# Altium schematic sheet IPT-LXe Top.SchDoc
size 393 x 520 mm; SheetNumber: 0; SheetTotal: 0; PageSetup: Record=PageOptions|CenterHorizontal=True|CenterVertical=True|PrintScale=0.50|XCorrection=1.00|YCorrection=1.00|PrintKind=2|BorderSize=5000000|LeftOffset=0|BottomOffset=0|Orientation=1|PaperLength=1000|PaperWidth=1000|Scale=100|PaperSource=257|PrintQuality=600|MediaType=1|DitherType=10|PaperKind=A2|PrintScaleMode=1
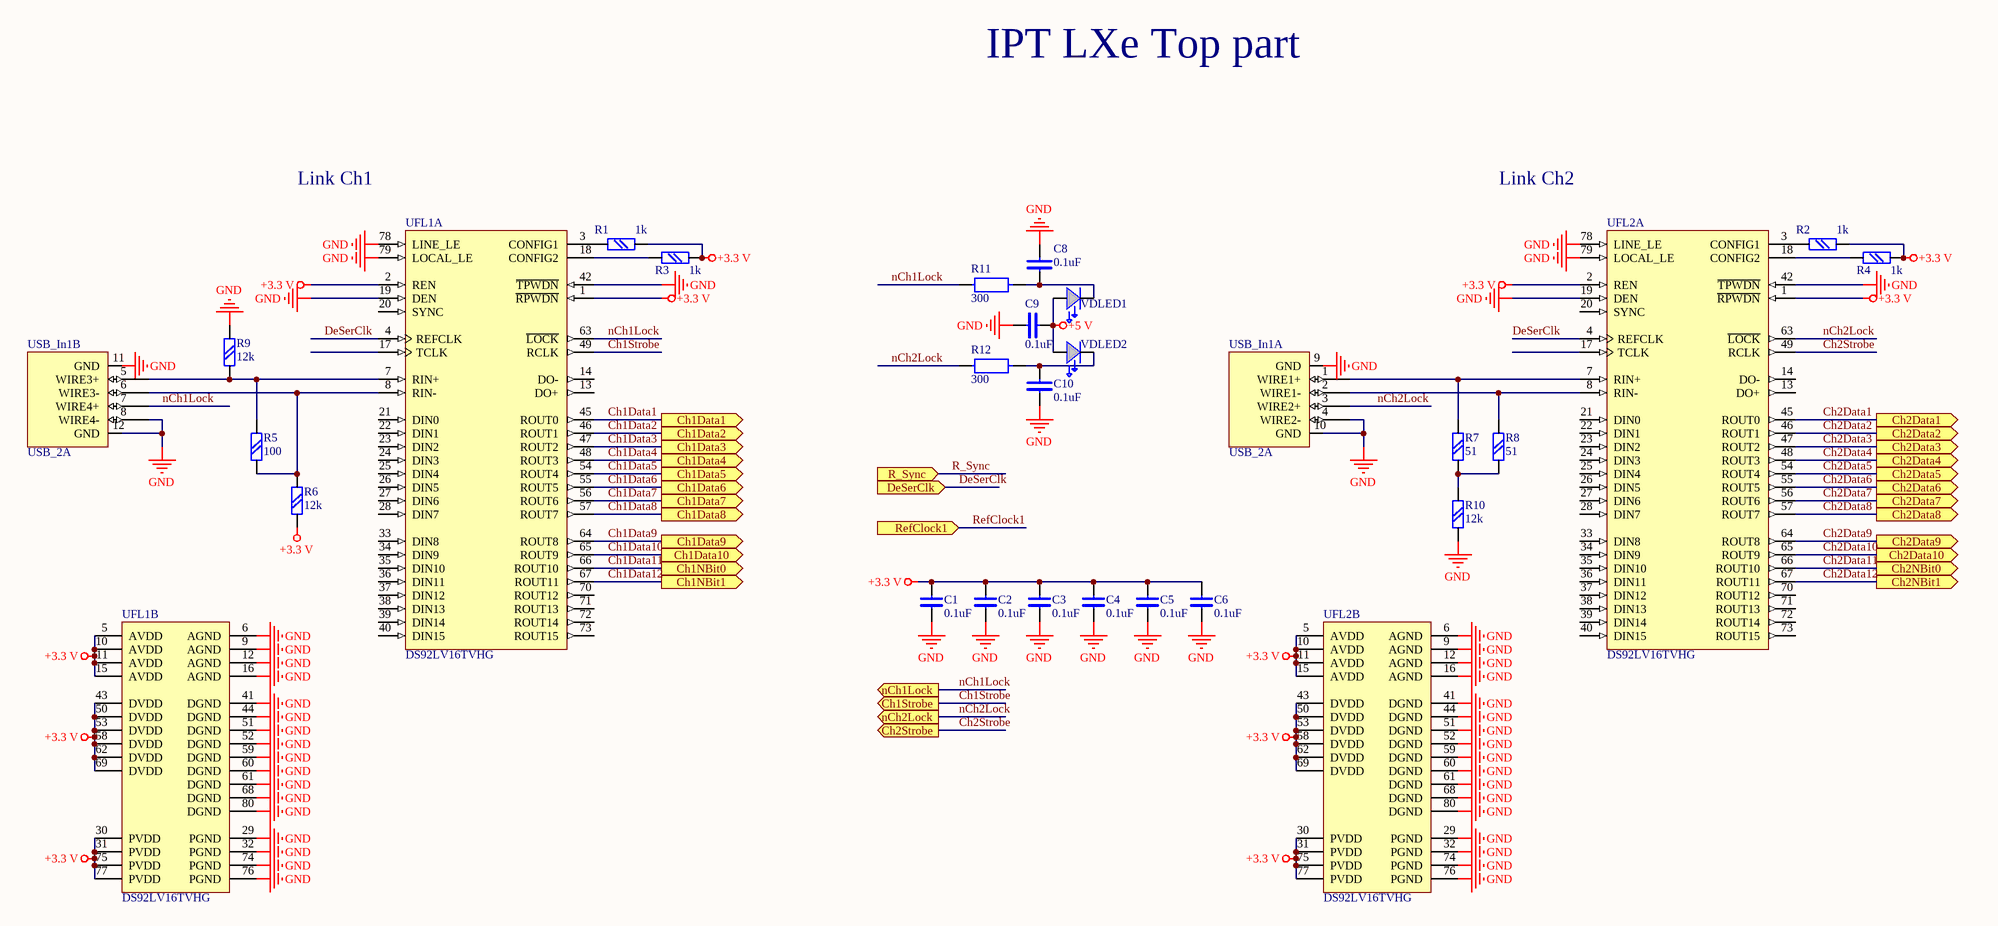
[diagram p0: IPT-LXe Top.SchDoc]

## Parts
C1  0.1uF  [chip0805]
C2  0.1uF  [chip0805]
C3  0.1uF  [chip0805]
C4  0.1uF  [chip0805]
C5  0.1uF  [chip0805]
C6  0.1uF  [chip0805]
C8  0.1uF  [chip0805]
C9  0.1uF  [chip0805]
C10  0.1uF  [chip0805]
R1  1k  [chip0805]
R2  1k  [chip0805]
R3  1k  [chip0805]
R4  1k  [chip0805]
R5  100  [chip0805]
R6  12k  [chip0805]
R7  51  [chip0805]
R8  51  [chip0805]
R9  12k  [chip0805]
R10  12k  [chip0805]
R11  300  [chip0805]
R12  300  [chip0805]
UFL1  DS92LV16TVHG  [VHG80A_N]  (parts A,B of 2)
UFL2  DS92LV16TVHG  [VHG80A_N]  (parts A,B of 2)
USB_In1  USB_2A  [USB_2A]  (parts A,B of 2)
VDLED1  LED  [LED2P5_H]  (value not drawn)
VDLED2  LED  [LED2P5_H]  (value not drawn)

## Ports
Ch1Data1 (out), Ch1Data2 (out), Ch1Data3 (out), Ch1Data4 (out), Ch1Data5 (out), Ch1Data6 (out), Ch1Data7 (out), Ch1Data8 (out), Ch1Data9 (out), Ch1Data10 (out), Ch1NBit0 (out), Ch1NBit1 (out), Ch1Strobe (out), Ch2Data1 (out), Ch2Data2 (out), Ch2Data3 (out), Ch2Data4 (out), Ch2Data5 (out), Ch2Data6 (out), Ch2Data7 (out), Ch2Data8 (out), Ch2Data9 (out), Ch2Data10 (out), Ch2NBit0 (out), Ch2NBit1 (out), Ch2Strobe (out), DeSerClk (in), nCh1Lock (out), nCh2Lock (out), R_Sync (in), RefClock1 (in)

## Nets
+3.3 V: C1.2 C2.2 C3.2 C4.2 C5.2 C6.2 R1.2 R2.2 R3.2 R4.2 R6.1 UFL1.1(~{RPWDN}) UFL1.2(REN) UFL1.5(AVDD) UFL1.10(AVDD) UFL1.11(AVDD) UFL1.15(AVDD) UFL1.30(PVDD) UFL1.31(PVDD) UFL1.43(DVDD) UFL1.50(DVDD) UFL1.53(DVDD) UFL1.58(DVDD) UFL1.62(DVDD) UFL1.69(DVDD) UFL1.75(PVDD) UFL1.77(PVDD) UFL2.1(~{RPWDN}) UFL2.2(REN) UFL2.5(AVDD) UFL2.10(AVDD) UFL2.11(AVDD) UFL2.15(AVDD) UFL2.30(PVDD) UFL2.31(PVDD) UFL2.43(DVDD) UFL2.50(DVDD) UFL2.53(DVDD) UFL2.58(DVDD) UFL2.62(DVDD) UFL2.69(DVDD) UFL2.75(PVDD) UFL2.77(PVDD)
+5 V: C9.2 VDLED1.ANOD VDLED2.ANOD
GND: C1.1 C2.1 C3.1 C4.1 C5.1 C6.1 C8.1 C9.1 C10.2 R9.1 R10.1 UFL1.6(AGND) UFL1.9(AGND) UFL1.12(AGND) UFL1.16(AGND) UFL1.19(DEN) UFL1.29(PGND) UFL1.32(PGND) UFL1.41(DGND) UFL1.42(~{TPWDN}) UFL1.44(DGND) UFL1.51(DGND) UFL1.52(DGND) UFL1.59(DGND) UFL1.60(DGND) UFL1.61(DGND) UFL1.68(DGND) UFL1.74(PGND) UFL1.76(PGND) UFL1.78(LINE_LE) UFL1.79(LOCAL_LE) UFL1.80(DGND) UFL2.6(AGND) UFL2.9(AGND) UFL2.12(AGND) UFL2.16(AGND) UFL2.19(DEN) UFL2.29(PGND) UFL2.32(PGND) UFL2.41(DGND) UFL2.42(~{TPWDN}) UFL2.44(DGND) UFL2.51(DGND) UFL2.52(DGND) UFL2.59(DGND) UFL2.60(DGND) UFL2.61(DGND) UFL2.68(DGND) UFL2.74(PGND) UFL2.76(PGND) UFL2.78(LINE_LE) UFL2.79(LOCAL_LE) UFL2.80(DGND) USB_In1.4(WIRE2-) USB_In1.8(WIRE4-) USB_In1.9(GND) USB_In1.10(GND) USB_In1.11(GND) USB_In1.12(GND)
Ch1Data1: UFL1.45(ROUT0) ; port Ch1Data1
Ch1Data2: UFL1.46(ROUT1) ; port Ch1Data2
Ch1Data3: UFL1.47(ROUT2) ; port Ch1Data3
Ch1Data4: UFL1.48(ROUT3) ; port Ch1Data4
Ch1Data5: UFL1.54(ROUT4) ; port Ch1Data5
Ch1Data6: UFL1.55(ROUT5) ; port Ch1Data6
Ch1Data7: UFL1.56(ROUT6) ; port Ch1Data7
Ch1Data8: UFL1.57(ROUT7) ; port Ch1Data8
Ch1Data9: UFL1.64(ROUT8) ; port Ch1Data9
Ch1Data10: UFL1.65(ROUT9) ; port Ch1Data10
Ch1Data11: UFL1.66(ROUT10) ; port Ch1NBit0
Ch1Data12: UFL1.67(ROUT11) ; port Ch1NBit1
Ch1Strobe: UFL1.49(RCLK) ; port Ch1Strobe
Ch2Data1: UFL2.45(ROUT0) ; port Ch2Data1
Ch2Data2: UFL2.46(ROUT1) ; port Ch2Data2
Ch2Data3: UFL2.47(ROUT2) ; port Ch2Data3
Ch2Data4: UFL2.48(ROUT3) ; port Ch2Data4
Ch2Data5: UFL2.54(ROUT4) ; port Ch2Data5
Ch2Data6: UFL2.55(ROUT5) ; port Ch2Data6
Ch2Data7: UFL2.56(ROUT6) ; port Ch2Data7
Ch2Data8: UFL2.57(ROUT7) ; port Ch2Data8
Ch2Data9: UFL2.64(ROUT8) ; port Ch2Data9
Ch2Data10: UFL2.65(ROUT9) ; port Ch2Data10
Ch2Data11: UFL2.66(ROUT10) ; port Ch2NBit0
Ch2Data12: UFL2.67(ROUT11) ; port Ch2NBit1
Ch2Strobe: UFL2.49(RCLK) ; port Ch2Strobe
DeSerClk: UFL1.4(REFCLK) UFL2.4(REFCLK) ; port DeSerClk
nCh1Lock: R11.1 UFL1.63(~{LOCK}) USB_In1.7(WIRE4+) ; port nCh1Lock
nCh2Lock: R12.1 UFL2.63(~{LOCK}) USB_In1.3(WIRE2+) ; port nCh2Lock
R_Sync: port R_Sync
RefClock1: port RefClock1
NetC8_2: C8.2 R11.2 VDLED1.CATH
NetC10_1: C10.1 R12.2 VDLED2.CATH
NetR1_1: R1.1 UFL1.3(CONFIG1)
NetR2_1: R2.1 UFL2.3(CONFIG1)
NetR3_1: R3.1 UFL1.18(CONFIG2)
NetR4_1: R4.1 UFL2.18(CONFIG2)
NetR5_1: R5.1 R6.2 UFL1.8(RIN-) USB_In1.6(WIRE3-)
NetR5_2: R5.2 R9.2 UFL1.7(RIN+) USB_In1.5(WIRE3+)
NetR7_1: R7.1 R8.1 R10.2
NetR7_2: R7.2 UFL2.7(RIN+) USB_In1.1(WIRE1+)
NetR8_2: R8.2 UFL2.8(RIN-) USB_In1.2(WIRE1-)

Not connected (* = marked no-connect by the designer): UFL1 13(DO+) 14(DO-) 17(TCLK) 20(SYNC) 21(DIN0) 22(DIN1) 23(DIN2) 24(DIN3) 25(DIN4) 26(DIN5) 27(DIN6) 28(DIN7) 33(DIN8) 34(DIN9) 35(DIN10) 36(DIN11) 37(DIN12) 38(DIN13) 39(DIN14) 40(DIN15) 70(ROUT12) 71(ROUT13) 72(ROUT14) 73(ROUT15); UFL2 13(DO+) 14(DO-) 17(TCLK) 20(SYNC) 21(DIN0) 22(DIN1) 23(DIN2) 24(DIN3) 25(DIN4) 26(DIN5) 27(DIN6) 28(DIN7) 33(DIN8) 34(DIN9) 35(DIN10) 36(DIN11) 37(DIN12) 38(DIN13) 39(DIN14) 40(DIN15) 70(ROUT12) 71(ROUT13) 72(ROUT14) 73(ROUT15)

## Notes on the sheet
- IPT LXe Top part
- Link Ch1
- Link Ch2

## Library data of the parts
C1-C6 = C: Text Field1: 20; Text Field2: 10
C8-C10 = C
R1-R10 = R: Text Field1: 20; Text Field2: 20
R11 R12 = R
UFL1 UFL2 = DS92LV16TVHG: 16-Bit Bus LVDS Serializer/Deserializer - 25 - 80 MHz, 80-pin LQFP; Manufacturer: National Semiconductor; PackageTopMarking: NSUZXYTTE#*DS92LV16TVHG*BBBBB; PowerWise: N; CompType: Interface IC; Published: 4-Dec-2008; DatasheetVersion: Feb-2002; PackageVersion: revE, Feb-2005; PackageReference: VHG80A; Publisher: Altium Limited; PackageDescription: LQFP, Jedec, Metric, 12 x 12 x 1.4mm, 80 Lead, 0.5mm Pitch; Supplier 1: Farnell; Supplier Part Number 1: 8206848; PartNumber: DS92LV16TVHG; RoHS: N; PinCount: 80; Code_JEDEC: MS-026-BDD; ComponentLink1Description: DS92LV16 Datasheet; ComponentLink1URL: http://www.national.com/ds/DS/DS92LV16.pdf; ComponentLink2Description: DS92LV16 Web Page; ComponentLink2URL: http://www.national.com/pf/DS/DS92LV16.html; ComponentLink3Description: VHG80A Package Page; ComponentLink3URL: http://www.national.com/packaging/folders/vhg80a.html
VDLED1 VDLED2 = AL307: Text Field1: 10; Text Field2: 30